# Altium schematic sheet Power_Supply_Signal_Conditioning.SchDoc
size A4; CompanyName: Technische Hochschule Nürnberg Georg Simon Ohm; Organization: UltraZohm; Address1: Kesslerplatz 12; Address2: 90489 Nürnberg; Address3: GERMANY; SheetNumber: 5; SheetTotal: 6; Website: www.ultrazohm.com
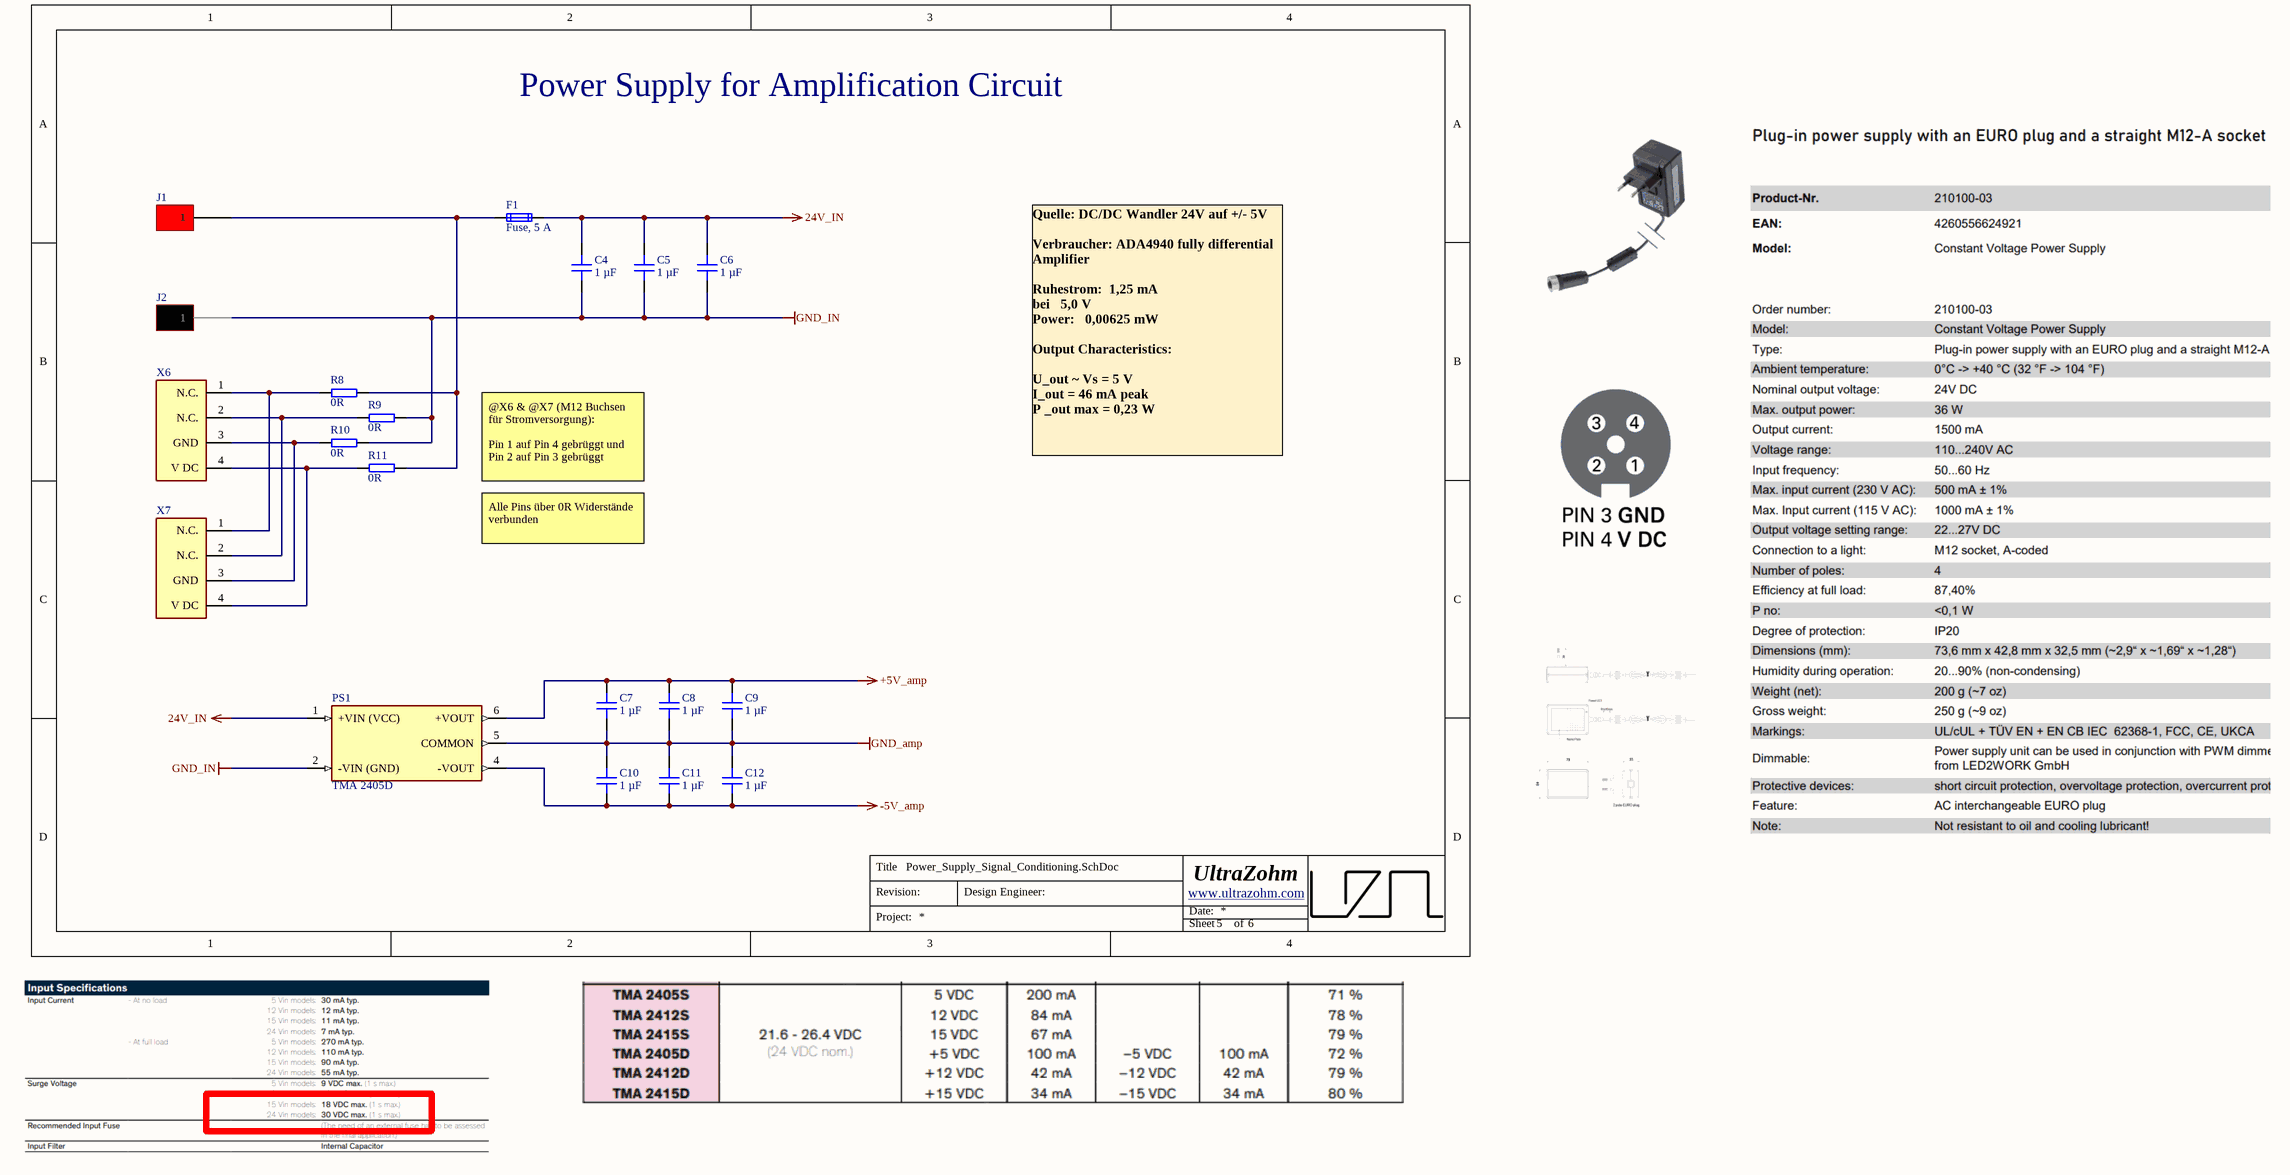
[diagram p0: Power_Supply_Signal_Conditioning.SchDoc]

## Parts
C4  1 µF  [C_0603]
C5  1 µF  [C_0603]
C6  1 µF  [C_0603]
C7  1 µF  [C_0603]
C8  1 µF  [C_0603]
C9  1 µF  [C_0603]
C10  1 µF  [C_0603]
C11  1 µF  [C_0603]
C12  1 µF  [C_0603]
F1  Fuse, 5 A  [0154xxx]
J1  FCR7350R, PCB mount 4mm jack, RED  [FCR7350]  (value not drawn)
J2  FCR7350B, PCB mount 4mm jack, BLACK  [FCR7350]  (value not drawn)
PS1  TMA 2405D  [SIP7]
R8  0R  [RES 1206_3216]
R9  0R  [RES 1206_3216]
R10  0R  [RES 1206_3216]
R11  0R  [RES 1206_3216]
X6  CAZN_M12-P4A-GPL_M12  [CAZN_M12-P4A-GPL_M12]  (value not drawn)
X7  CAZN_M12-P4A-GPL_M12  [CAZN_M12-P4A-GPL_M12]  (value not drawn)

## Nets
24V_IN: C4.1 C5.1 C6.1 F1.2 PS1.1(+VIN_(VCC))
+5V_amp: C7.2 C8.2 C9.2 PS1.6(+VOUT)
-5V_amp: C10.1 C11.1 C12.1 PS1.4(-VOUT)
GND_amp: C7.1 C8.1 C9.1 C10.2 C11.2 C12.2 PS1.5(COMMON)
GND_IN: C4.2 C5.2 C6.2 J2.1 PS1.2(-VIN_(GND)) R9.2 R10.2
NetF1_1: F1.1 J1.1 R8.2 R11.2
NetR8_1: R8.1 X6.1(N.C.) X7.1(N.C.)
NetR9_1: R9.1 X6.2(N.C.) X7.2(N.C.)
NetR10_1: R10.1 X6.3(GND) X7.3(GND)
NetR11_1: R11.1 X6.4(V_DC) X7.4(V_DC)

## Notes on the sheet
- Power Supply for Amplification Circuit
- @X6 & @X7 (M12 Buchsen für Stromversorgung):
  Pin 1 auf Pin 4 gebrüggt und
  Pin 2 auf Pin 3 gebrüggt
- Quelle: DC/DC Wandler 24V auf +/- 5V
  Verbraucher: ADA4940 fully differential Amplifier
  Ruhestrom: 	1,25 mA
  bei 		5,0 V
  Power: 		0,00625 mW
  Output Characteristics:
  U_out ~ Vs = 5 V
  I_out = 46 mA peak
  P _out max = 0,23 W
- Alle Pins über 0R Widerstände verbunden
- Title
- Revision:
- Design Engineer:
- Date:
- Project:
- Sheet
- of

## Library data of the parts
C4-C12 = CL10A105KB8NNNC: 50V 1uF X5R ±10% 0603  Multilayer Ceramic Capacitors MLCC - SMD/SMT ROHS; Manufacturer: Samsung Electro-Mechanics; Voltage Rating: 50 VDC; Created from: MGremer; Supplier 1: LCSC; Supplier Part Number 1: C15849; Manufacturer Part Number: CL10A105KB8NNNC; Value: 1 µF; PartID: 5; ComponentLink1Description: Datasheet; ComponentLink1URL: https://datasheet.lcsc.com/lcsc/1810261812_Samsung-Electro-Mechanics-CL10A105KB8NNNC_C15849.pdf; Component Type: Capacitor 0603; Device Package: 0603; Mounting Type: SMD; Operating Temperature: -55 - 85°C; Series: M; Type: Capacitor; Tolerance: 10 %; Live Cycle Status: 1; LCSC Part Number: C15849; Stock number: Labor SMD Container
  C4 C5 C7-C12: Created On: 20.12.2020 13:54:13; Last Updated: 28.11.2022 17:23:01
  C6: Created On: 20/12/2020 13:54:13; Last Updated: 28/11/2022 17:23:01
F1 = 0154005.DR: Fuse OMNI BLOK 154; Manufacturer: Littlefuse; Nominal current: 5 A; Nominal voltage AC: 125 VAC; Nominal voltage DC: 125 VDC; Resistance: 12.5 mOhm; Created from: MGremer; Manufacturer Part Number: 0154005.DR; PartID: 1; Created On: 07/01/2021 10:17:19; ComponentLink1Description: Datasheet; ComponentLink1URL: https://www.mouser.de/datasheet/2/240/Littelfuse_Fuse_154_154T_154L_154TL_Datasheet_pdf-365375.pdf; Component Type: NAN02 - 154 OMNI-BLOK; Device Package: OMNI-BLOK; Last Updated: 12/08/2025 20:50:24; Mounting Type: SMD; Operating Temperature: -55 - 125 °C; Series: 154; Supplier 1: Mouser; Supplier Part Number 1: 576-0154005.DR; Supplier 2: LCSC; Supplier Part Number 2: C206916; Type: Fuse; Value: Fuse, 5 A; Live Cycle Status: 1; LCSC Part Number: C206916
J1 = FCR7350R: FCR7350B, 1000V, 24A, RED; Manufacturer: Cliff; Value: PCB mount 4mm jack, Red FCR7350R, 1000V, 24A; Created from: DHufnagel; Manufacturer Part Number: FCR7350R; PartID: 7; Created On: 13/06/2022 10:18:11; ComponentLink1Description: datasheet; ComponentLink1URL: https://www.cliffuk.co.uk/products/testleads/sockets/S16NPC.pdf; ComponentLink2Description: drawing; ComponentLink2URL: https://media.digikey.com/pdf/Data%20Sheets/Cliff%20Electronic%20LTD%20PDF's/FCR7350_Drawing.pdf; Component Type: PCB mount 4mm jack, Red; Device Package: THT; Last Updated: 21/02/2024 15:19:13; Minimum Order: 1; Mounting Type: THT; Operating Temperature: -40°C - 80°C; Series: S16N-PC; Supplier 1: Digi-Key; Supplier Part Number 1: 3185-FCR7350R-ND; Supplier 2: farnell; Supplier Part Number 2: 1854508; Supplier 3: LCSC; Supplier Part Number 3: C7437326; Type: PCB mount 4mm jack, Red FCR7350R, 1000V, 24A; Live Cycle Status: 1; LCSC Part Number: C7437326; Stock number: not stored
J2 = FCR7350B: FCR7350B, 1000V, 24A, BLACK; Manufacturer: Cliff; Value: PCB mount 4mm jack, Black	FCR7350B, 1000V, 24A; Created from: DHufnagel; Manufacturer Part Number: FCR7350B; PartID: 6; Created On: 13/06/2022 10:18:11; ComponentLink1Description: datasheet; ComponentLink1URL: https://www.cliffuk.co.uk/products/testleads/sockets/S16NPC.pdf; ComponentLink2Description: drawing; ComponentLink2URL: https://media.digikey.com/pdf/Data%20Sheets/Cliff%20Electronic%20LTD%20PDF's/FCR7350_Drawing.pdf; Component Type: PCB mount 4mm jack, Black; Device Package: THT; Last Updated: 21/02/2024 15:21:29; Minimum Order: 1; Mounting Type: THT; Operating Temperature: -40°C - 80°C; Series: S16N-PC; Supplier 1: Digi-Key; Supplier Part Number 1: 3185-FCR7350B-ND; Supplier 2: farnell; Supplier Part Number 2: 1854507; Supplier 3: LCSC; Supplier Part Number 3: C7437327; Type: PCB mount 4mm jack, Black	FCR7350B, 1000V, 24A; Live Cycle Status: 1; LCSC Part Number: C7437327; Stock number: not stored
PS1 = TMA 2405D: 22-26 V Input, +/- 5 V @100mA  Output, 1 W, isolated DC/DC-converter; Manufacturer: TRACO Power; Created from: TGaupp; Manufacturer Part Number: TMA 2405D; PartID: 21; Created On: 24/02/2026 14:55:36; ComponentLink1Description: Datasheet; ComponentLink1URL: https://www.lcsc.com/datasheet/C6285339.pdf; Component Type: Isolated DC/DC; Last Updated: 24/02/2026 15:06:39; Mounting Type: THT; Operating Temperature: -40 - 85 °C; Supplier 1: LCSC; Supplier Part Number 1: C6285339; Type: Isolated DC/DC; Live Cycle Status: 1; LCSC Part Number: C6285339; Stock number: not stored
R8-R11 = 1206W4F0000T5E: 250mW Thick Film Resistors ±800ppm/℃ ±1% 0Ω 1206 Chip Resistor - Surface Mount ROHS; Manufacturer: UNI-ROYAL; Created from: AGeiger; Manufacturer Part Number: 1206W4F0000T5E; PartID: 271; Created On: 06/06/2023 20:12:49; ComponentLink1Description: Datasheet; ComponentLink1URL: https://datasheet.lcsc.com/lcsc/2206010200_UNI-ROYAL-Uniroyal-Elec-1206W4F0000T5E_C17888.pdf; Component Type: SMD resistor; Device Package: 1206; Last Updated: 27/05/2026 08:49:04; Mounting Type: SMD; Supplier 1: LCSC; Supplier Part Number 1: C17888; Supplier 2: Mouser; Supplier Part Number 2: 303-1206W4F0000T5E; Type: Resistor; Tolerance: 1%; Value: 0R; Live Cycle Status: 1; LCSC Part Number: C17888
X6 X7 = CAZN_M12-P4A-GPL_M12: M12 Metric Circular Connector, A-Coded, Metal Non-shielded, 4A, 04 pins, Male Connector, Male Contact, Hexagonal, M12*1.0, Screw Thread, PCB 90°; Manufacturer: CAZN; Created from: TGaupp; Manufacturer Part Number: CAZN_M12-P4A-GPL_M12; PartID: 31; Created On: 03/06/2026 11:54:12; ComponentLink1Description: Datasheet; ComponentLink1URL: https://www.lcsc.com/datasheet/C19108992.pdf?spm=wm.sxq.inf.ggs___wm.fly.bg.0.xh&lcsc_vid=TwNaAlRSR1ldAVwCFFVbXlUCQQUIVQcDFgRYX1YFEwcxVlNeR1VZUFBQQ1RbXzsOAxUeFF5JWBYZEEoKFBINSQcJGk4eFQsCAgIaSgADAwAHC0slRVNfUVBSTlZADxALGw%3D%3D; Component Type: M12 A-Type 4 Pole Connector; Device Package: THT; Last Updated: 03/06/2026 13:55:49; Mounting Type: THT; Operating Temperature: -25℃ - 80 ℃; Supplier 1: LCSC; Supplier Part Number 1: C19108992; Type: M12 Connector; Live Cycle Status: 1; LCSC Part Number: C19108992; Stock number: not stored